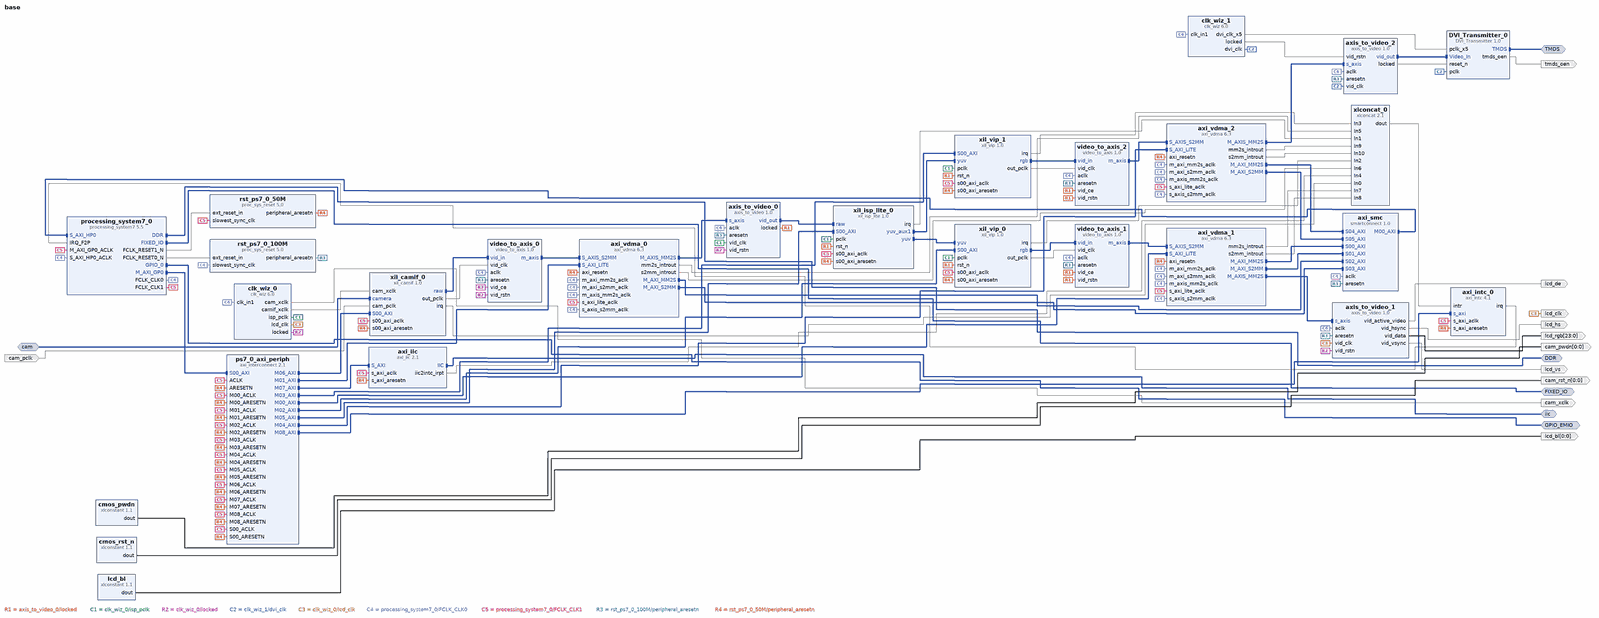
[diagram p0: block diagram of the top level, whole]
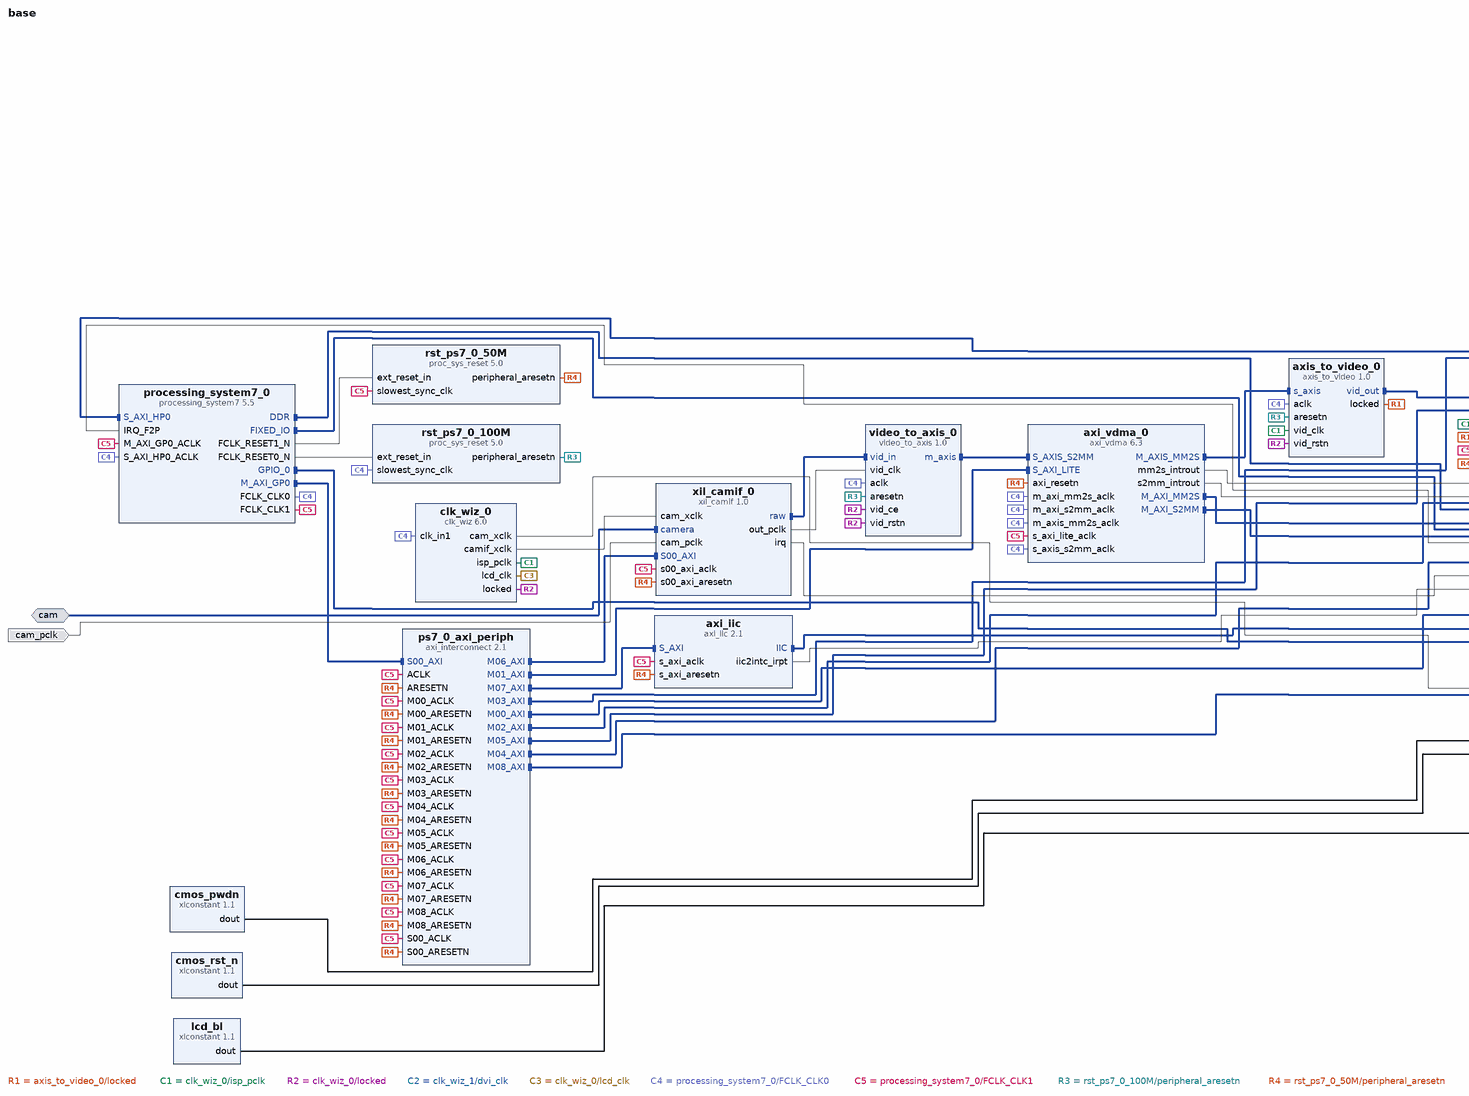
[diagram p1: block diagram of the top level, left part]
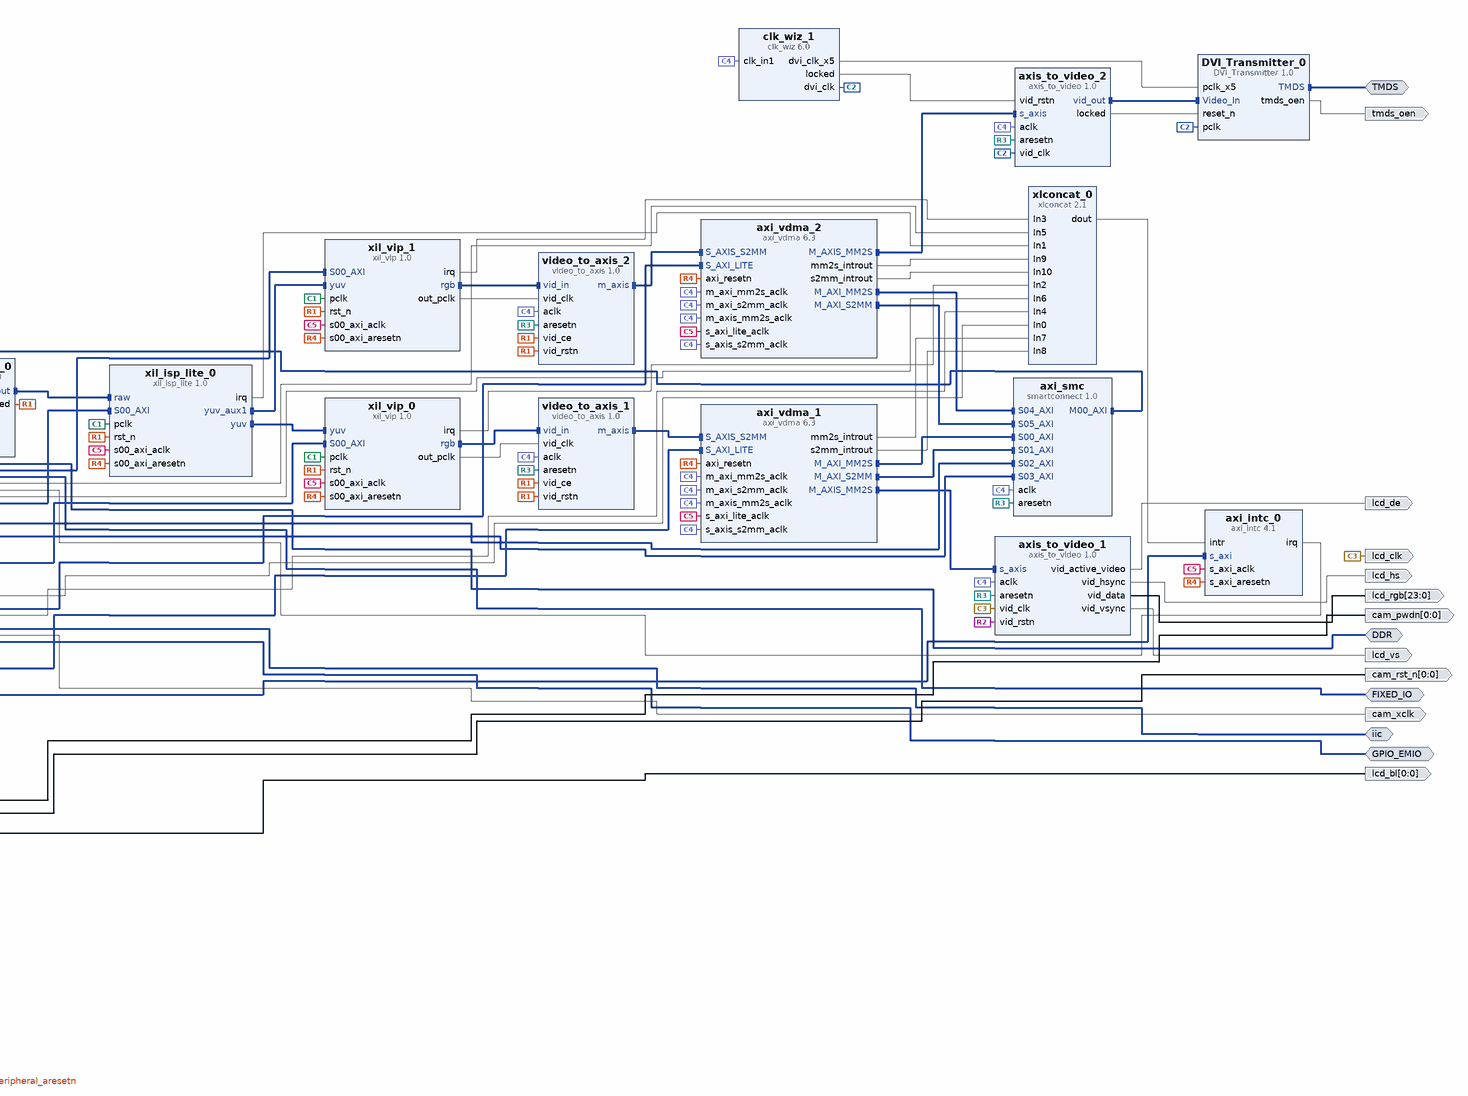
[diagram p2: block diagram of the top level, right part]
# Vivado block design base, xc7z020clg400-2, Vivado 2021.1
create_bd_design base

create_bd_intf_port -mode Master -vlnv xilinx.com:interface:ddrx_rtl:1.0 DDR
create_bd_intf_port -mode Master -vlnv xilinx.com:display_processing_system7:fixedio_rtl:1.0 FIXED_IO
create_bd_intf_port -mode Master -vlnv openedv.com:user:TMDS_rtl:1.0 TMDS
create_bd_intf_port -mode Slave -vlnv xilinx.com:interface:vid_io_rtl:1.0 cam
create_bd_intf_port -mode Master -vlnv xilinx.com:interface:iic_rtl:1.0 iic
create_bd_intf_port -mode Master -vlnv xilinx.com:interface:gpio_rtl:1.0 GPIO_EMIO
create_bd_port -dir O lcd_de
create_bd_port -dir O -from 23 -to 0 lcd_rgb
create_bd_port -dir O lcd_hs
create_bd_port -dir O lcd_vs
create_bd_port -dir O -type clk lcd_clk
create_bd_port -dir O -from 0 -to 0 lcd_bl
create_bd_port -dir O -from 0 -to 0 cam_rst_n
create_bd_port -dir O -from 0 -to 0 cam_pwdn
create_bd_port -dir O tmds_oen
create_bd_port -dir I -type clk cam_pclk
create_bd_port -dir O -type clk cam_xclk
set_property -dict {CONFIG.FREQ_HZ 24000000} [get_bd_ports cam_xclk]

create_bd_cell -type ip -vlnv xilinx.com:ip:processing_system7:5.5 processing_system7_0
set_property -dict [list \
  CONFIG.PCW_APU_PERIPHERAL_FREQMHZ 666.666666 \
  CONFIG.PCW_CPU_CPU_6X4X_MAX_RANGE 767 \
  CONFIG.PCW_ENET0_PERIPHERAL_ENABLE 0 \
  CONFIG.PCW_EN_CLK1_PORT 1 \
  CONFIG.PCW_EN_RST1_PORT 1 \
  CONFIG.PCW_FCLK_CLK1_BUF TRUE \
  CONFIG.PCW_FPGA0_PERIPHERAL_FREQMHZ 120 \
  CONFIG.PCW_FPGA1_PERIPHERAL_FREQMHZ 50 \
  CONFIG.PCW_FPGA_FCLK1_ENABLE 1 \
  CONFIG.PCW_GPIO_EMIO_GPIO_ENABLE 1 \
  CONFIG.PCW_GPIO_EMIO_GPIO_IO 5 \
  CONFIG.PCW_GPIO_EMIO_GPIO_WIDTH 5 \
  CONFIG.PCW_GPIO_MIO_GPIO_ENABLE 1 \
  CONFIG.PCW_GPIO_MIO_GPIO_IO MIO \
  CONFIG.PCW_I2C_RESET_ENABLE 0 \
  CONFIG.PCW_IRQ_F2P_INTR 1 \
  CONFIG.PCW_PERIPHERAL_BOARD_PRESET None \
  CONFIG.PCW_PRESET_BANK1_VOLTAGE {LVCMOS 1.8V} \
  CONFIG.PCW_QSPI_PERIPHERAL_ENABLE 0 \
  CONFIG.PCW_SD0_GRP_CD_ENABLE 1 \
  CONFIG.PCW_SD0_GRP_CD_IO {MIO 10} \
  CONFIG.PCW_SD0_GRP_WP_ENABLE 0 \
  CONFIG.PCW_SD0_PERIPHERAL_ENABLE 1 \
  CONFIG.PCW_SD0_SD0_IO {MIO 40 .. 45} \
  CONFIG.PCW_SDIO_PERIPHERAL_FREQMHZ 100 \
  CONFIG.PCW_UART0_PERIPHERAL_ENABLE 1 \
  CONFIG.PCW_UART0_UART0_IO {MIO 14 .. 15} \
  CONFIG.PCW_UART1_PERIPHERAL_ENABLE 0 \
  CONFIG.PCW_UART_PERIPHERAL_FREQMHZ 100 \
  CONFIG.PCW_UIPARAM_DDR_FREQ_MHZ 533.333333 \
  CONFIG.PCW_UIPARAM_DDR_PARTNO {MT41J256M16 RE-125} \
  CONFIG.PCW_USB0_PERIPHERAL_ENABLE 0 \
  CONFIG.PCW_USB_RESET_ENABLE 0 \
  CONFIG.PCW_USE_FABRIC_INTERRUPT 1 \
  CONFIG.PCW_USE_S_AXI_HP0 1 \
  CONFIG.preset None \
] [get_bd_cells processing_system7_0]
# 496 more settings of processing_system7_0 are not shown: defaults, MIO pin electricals, DDR timing, and values the tool derives
create_bd_cell -type ip -vlnv xilinx.com:ip:proc_sys_reset:5.0 rst_ps7_0_100M
create_bd_cell -type ip -vlnv xilinx.com:ip:proc_sys_reset:5.0 rst_ps7_0_50M
create_bd_cell -type ip -vlnv xilinx.com:ip:axi_iic:2.1 axi_iic
create_bd_cell -type ip -vlnv xilinx.com:ip:axi_intc:4.1 axi_intc_0
create_bd_cell -type ip -vlnv xilinx.com:ip:smartconnect:1.0 axi_smc
set_property -dict {CONFIG.NUM_SI 6} [get_bd_cells axi_smc]
create_bd_cell -type ip -vlnv xilinx.com:ip:axi_vdma:6.3 axi_vdma_0
set_property -dict [list \
  CONFIG.c_m_axis_mm2s_tdata_width 8 \
  CONFIG.c_mm2s_linebuffer_depth 4096 \
  CONFIG.c_mm2s_max_burst_length 256 \
  CONFIG.c_s2mm_linebuffer_depth 4096 \
  CONFIG.c_s2mm_max_burst_length 256 \
] [get_bd_cells axi_vdma_0]
create_bd_cell -type ip -vlnv xilinx.com:ip:axi_vdma:6.3 axi_vdma_1
set_property -dict [list \
  CONFIG.c_m_axis_mm2s_tdata_width 24 \
  CONFIG.c_mm2s_linebuffer_depth 1024 \
  CONFIG.c_mm2s_max_burst_length 32 \
  CONFIG.c_s2mm_linebuffer_depth 1024 \
  CONFIG.c_s2mm_max_burst_length 32 \
] [get_bd_cells axi_vdma_1]
create_bd_cell -type ip -vlnv xilinx.com:ip:axi_vdma:6.3 axi_vdma_2
set_property -dict [list \
  CONFIG.c_m_axis_mm2s_tdata_width 24 \
  CONFIG.c_mm2s_linebuffer_depth 2048 \
  CONFIG.c_mm2s_max_burst_length 32 \
  CONFIG.c_s2mm_linebuffer_depth 2048 \
  CONFIG.c_s2mm_max_burst_length 32 \
] [get_bd_cells axi_vdma_2]
create_bd_cell -type ip -vlnv xilinx.com:ip:clk_wiz:6.0 clk_wiz_0
set_property -dict [list \
  CONFIG.CLKIN1_JITTER_PS 83.33 \
  CONFIG.CLKOUT1_JITTER 114.420 \
  CONFIG.CLKOUT1_PHASE_ERROR 86.077 \
  CONFIG.CLKOUT1_REQUESTED_OUT_FREQ 96 \
  CONFIG.CLKOUT2_JITTER 109.763 \
  CONFIG.CLKOUT2_PHASE_ERROR 86.077 \
  CONFIG.CLKOUT2_REQUESTED_OUT_FREQ 120 \
  CONFIG.CLKOUT2_USED true \
  CONFIG.CLKOUT3_JITTER 141.764 \
  CONFIG.CLKOUT3_PHASE_ERROR 86.077 \
  CONFIG.CLKOUT3_REQUESTED_OUT_FREQ 33.333 \
  CONFIG.CLKOUT3_USED true \
  CONFIG.CLKOUT4_JITTER 152.237 \
  CONFIG.CLKOUT4_PHASE_ERROR 86.077 \
  CONFIG.CLKOUT4_REQUESTED_OUT_FREQ 24 \
  CONFIG.CLKOUT4_USED true \
  CONFIG.CLK_OUT1_PORT camif_xclk \
  CONFIG.CLK_OUT2_PORT isp_pclk \
  CONFIG.CLK_OUT3_PORT lcd_clk \
  CONFIG.CLK_OUT4_PORT cam_xclk \
  CONFIG.MMCM_CLKFBOUT_MULT_F 10.000 \
  CONFIG.MMCM_CLKIN1_PERIOD 8.333 \
  CONFIG.MMCM_CLKIN2_PERIOD 10.000 \
  CONFIG.MMCM_CLKOUT0_DIVIDE_F 12.500 \
  CONFIG.MMCM_CLKOUT1_DIVIDE 10 \
  CONFIG.MMCM_CLKOUT2_DIVIDE 36 \
  CONFIG.MMCM_CLKOUT3_DIVIDE 50 \
  CONFIG.MMCM_DIVCLK_DIVIDE 1 \
  CONFIG.NUM_OUT_CLKS 4 \
  CONFIG.USE_RESET false \
] [get_bd_cells clk_wiz_0]
create_bd_cell -type ip -vlnv xilinx.com:ip:clk_wiz:6.0 clk_wiz_1
set_property -dict [list \
  CONFIG.CLKIN1_JITTER_PS 83.33 \
  CONFIG.CLKOUT1_DRIVES BUFG \
  CONFIG.CLKOUT1_JITTER 187.199 \
  CONFIG.CLKOUT1_PHASE_ERROR 196.436 \
  CONFIG.CLKOUT1_REQUESTED_OUT_FREQ 74.25 \
  CONFIG.CLKOUT2_DRIVES BUFG \
  CONFIG.CLKOUT2_JITTER 145.809 \
  CONFIG.CLKOUT2_PHASE_ERROR 196.436 \
  CONFIG.CLKOUT2_REQUESTED_OUT_FREQ 371.25 \
  CONFIG.CLKOUT2_USED true \
  CONFIG.CLKOUT3_DRIVES BUFG \
  CONFIG.CLKOUT4_DRIVES BUFG \
  CONFIG.CLKOUT5_DRIVES BUFG \
  CONFIG.CLKOUT6_DRIVES BUFG \
  CONFIG.CLKOUT7_DRIVES BUFG \
  CONFIG.CLK_OUT1_PORT dvi_clk \
  CONFIG.CLK_OUT2_PORT dvi_clk_x5 \
  CONFIG.FEEDBACK_SOURCE FDBK_AUTO \
  CONFIG.MMCM_CLKFBOUT_MULT_F 37.125 \
  CONFIG.MMCM_CLKIN1_PERIOD 8.333 \
  CONFIG.MMCM_CLKIN2_PERIOD 10.000 \
  CONFIG.MMCM_CLKOUT0_DIVIDE_F 15.000 \
  CONFIG.MMCM_CLKOUT1_DIVIDE 3 \
  CONFIG.MMCM_COMPENSATION ZHOLD \
  CONFIG.MMCM_DIVCLK_DIVIDE 4 \
  CONFIG.NUM_OUT_CLKS 2 \
  CONFIG.PRIMITIVE MMCM \
  CONFIG.USE_RESET false \
] [get_bd_cells clk_wiz_1]
create_bd_cell -type ip -vlnv xilinx.com:ip:xlconstant:1.1 cmos_pwdn
set_property -dict {CONFIG.CONST_VAL 0} [get_bd_cells cmos_pwdn]
create_bd_cell -type ip -vlnv xilinx.com:ip:xlconstant:1.1 cmos_rst_n
create_bd_cell -type ip -vlnv xilinx.com:ip:xlconstant:1.1 lcd_bl
create_bd_cell -type ip -vlnv xilinx.com:ip:axi_interconnect:2.1 ps7_0_axi_periph
set_property -dict {CONFIG.NUM_MI 9} [get_bd_cells ps7_0_axi_periph]
create_bd_cell -type ip -vlnv xilinx.com:ip:xlconcat:2.1 xlconcat_0
set_property -dict {CONFIG.NUM_PORTS 11 CONFIG.dout_width 11} [get_bd_cells xlconcat_0]
create_bd_cell -type ip -vlnv openedv.com:user:DVI_Transmitter:1.0 DVI_Transmitter_0
create_bd_cell -type ip -vlnv bxq.com:user:axis_to_video:1.0 axis_to_video_0
set_property -dict {CONFIG.ADDR_BITS 12 CONFIG.H_DISP 2592 CONFIG.V_DISP 1944} [get_bd_cells axis_to_video_0]
create_bd_cell -type ip -vlnv bxq.com:user:axis_to_video:1.0 axis_to_video_1
set_property -dict [list \
  CONFIG.ADDR_BITS 10 \
  CONFIG.DATA_BITS 24 \
  CONFIG.H_BACK 88 \
  CONFIG.H_DISP 800 \
  CONFIG.H_FRONT 40 \
  CONFIG.H_PULSE 128 \
  CONFIG.V_BACK 33 \
  CONFIG.V_DISP 480 \
  CONFIG.V_FRONT 10 \
  CONFIG.V_PULSE 2 \
] [get_bd_cells axis_to_video_1]
create_bd_cell -type ip -vlnv bxq.com:user:axis_to_video:1.0 axis_to_video_2
set_property -dict [list \
  CONFIG.ADDR_BITS 11 \
  CONFIG.DATA_BITS 24 \
  CONFIG.H_BACK 220 \
  CONFIG.H_FRONT 110 \
  CONFIG.H_PULSE 40 \
  CONFIG.V_BACK 21 \
  CONFIG.V_DISP 720 \
  CONFIG.V_FRONT 4 \
  CONFIG.V_PULSE 5 \
] [get_bd_cells axis_to_video_2]
create_bd_cell -type ip -vlnv bxq.com:user:video_to_axis:1.0 video_to_axis_0
set_property -dict {CONFIG.ADDR_BITS 12} [get_bd_cells video_to_axis_0]
create_bd_cell -type ip -vlnv bxq.com:user:video_to_axis:1.0 video_to_axis_1
set_property -dict {CONFIG.ADDR_BITS 10 CONFIG.DATA_BITS 24} [get_bd_cells video_to_axis_1]
create_bd_cell -type ip -vlnv bxq.com:user:video_to_axis:1.0 video_to_axis_2
set_property -dict {CONFIG.ADDR_BITS 11 CONFIG.DATA_BITS 24} [get_bd_cells video_to_axis_2]
create_bd_cell -type ip -vlnv bxq.com:user:xil_camif:1.0 xil_camif_0
set_property -dict [list \
  CONFIG.COLORBAR_BAYER 3 \
  CONFIG.COLORBAR_H_BACK 50 \
  CONFIG.COLORBAR_H_DISP 2592 \
  CONFIG.COLORBAR_H_FRONT 50 \
  CONFIG.COLORBAR_H_PULSE 100 \
  CONFIG.COLORBAR_V_BACK 5 \
  CONFIG.COLORBAR_V_DISP 1944 \
  CONFIG.COLORBAR_V_FRONT 5 \
  CONFIG.COLORBAR_V_PULSE 10 \
] [get_bd_cells xil_camif_0]
create_bd_cell -type ip -vlnv bxq.com:user:xil_isp_lite:1.0 xil_isp_lite_0
set_property -dict [list \
  CONFIG.BAYER 3 \
  CONFIG.EXT_BITS 1 \
  CONFIG.FEATURE_FULL true \
  CONFIG.HEIGHT 1944 \
  CONFIG.IO_BITS 8 \
  CONFIG.WIDTH 2592 \
  CONFIG.YUV_AUX_NUM 1 \
] [get_bd_cells xil_isp_lite_0]
create_bd_cell -type ip -vlnv bxq.com:user:xil_vip:1.0 xil_vip_0
set_property -dict {CONFIG.BITS 8 CONFIG.FEATURE_FULL true CONFIG.HEIGHT 1944 CONFIG.WIDTH 2592} [get_bd_cells xil_vip_0]
create_bd_cell -type ip -vlnv bxq.com:user:xil_vip:1.0 xil_vip_1
set_property -dict {CONFIG.FEATURE_FULL true CONFIG.HEIGHT 1944 CONFIG.WIDTH 2592} [get_bd_cells xil_vip_1]

# ---- connections ----

connect_bd_intf_net [get_bd_intf_ports TMDS] [get_bd_intf_pins DVI_Transmitter_0/TMDS]
connect_bd_intf_net [get_bd_intf_ports iic] [get_bd_intf_pins axi_iic/IIC]
connect_bd_intf_net [get_bd_intf_pins axi_smc/M00_AXI] [get_bd_intf_pins processing_system7_0/S_AXI_HP0]
connect_bd_intf_net [get_bd_intf_pins axi_vdma_0/M_AXIS_MM2S] [get_bd_intf_pins axis_to_video_0/s_axis]
connect_bd_intf_net [get_bd_intf_pins axi_vdma_0/M_AXI_MM2S] [get_bd_intf_pins axi_smc/S02_AXI]
connect_bd_intf_net [get_bd_intf_pins axi_vdma_0/M_AXI_S2MM] [get_bd_intf_pins axi_smc/S03_AXI]
connect_bd_intf_net [get_bd_intf_pins axi_vdma_1/M_AXIS_MM2S] [get_bd_intf_pins axis_to_video_1/s_axis]
connect_bd_intf_net [get_bd_intf_pins axi_vdma_1/M_AXI_MM2S] [get_bd_intf_pins axi_smc/S00_AXI]
connect_bd_intf_net [get_bd_intf_pins axi_vdma_1/M_AXI_S2MM] [get_bd_intf_pins axi_smc/S01_AXI]
connect_bd_intf_net [get_bd_intf_pins axis_to_video_2/s_axis] [get_bd_intf_pins axi_vdma_2/M_AXIS_MM2S]
connect_bd_intf_net [get_bd_intf_pins axi_vdma_2/M_AXI_MM2S] [get_bd_intf_pins axi_smc/S04_AXI]
connect_bd_intf_net [get_bd_intf_pins axi_vdma_2/M_AXI_S2MM] [get_bd_intf_pins axi_smc/S05_AXI]
connect_bd_intf_net [get_bd_intf_pins axis_to_video_0/vid_out] [get_bd_intf_pins xil_isp_lite_0/raw]
connect_bd_intf_net [get_bd_intf_pins axis_to_video_2/vid_out] [get_bd_intf_pins DVI_Transmitter_0/Video_In]
connect_bd_intf_net -intf_net camera_0_1 [get_bd_intf_ports cam] [get_bd_intf_pins xil_camif_0/camera]
connect_bd_intf_net [get_bd_intf_ports DDR] [get_bd_intf_pins processing_system7_0/DDR]
connect_bd_intf_net [get_bd_intf_ports FIXED_IO] [get_bd_intf_pins processing_system7_0/FIXED_IO]
connect_bd_intf_net [get_bd_intf_ports GPIO_EMIO] [get_bd_intf_pins processing_system7_0/GPIO_0]
connect_bd_intf_net [get_bd_intf_pins processing_system7_0/M_AXI_GP0] [get_bd_intf_pins ps7_0_axi_periph/S00_AXI]
connect_bd_intf_net [get_bd_intf_pins ps7_0_axi_periph/M00_AXI] [get_bd_intf_pins axi_vdma_1/S_AXI_LITE]
connect_bd_intf_net [get_bd_intf_pins ps7_0_axi_periph/M01_AXI] [get_bd_intf_pins axi_vdma_0/S_AXI_LITE]
connect_bd_intf_net [get_bd_intf_pins ps7_0_axi_periph/M02_AXI] [get_bd_intf_pins xil_vip_0/S00_AXI]
connect_bd_intf_net [get_bd_intf_pins ps7_0_axi_periph/M03_AXI] [get_bd_intf_pins xil_vip_1/S00_AXI]
connect_bd_intf_net [get_bd_intf_pins ps7_0_axi_periph/M04_AXI] [get_bd_intf_pins axi_vdma_2/S_AXI_LITE]
connect_bd_intf_net [get_bd_intf_pins ps7_0_axi_periph/M05_AXI] [get_bd_intf_pins xil_isp_lite_0/S00_AXI]
connect_bd_intf_net [get_bd_intf_pins ps7_0_axi_periph/M06_AXI] [get_bd_intf_pins xil_camif_0/S00_AXI]
connect_bd_intf_net [get_bd_intf_pins ps7_0_axi_periph/M07_AXI] [get_bd_intf_pins axi_iic/S_AXI]
connect_bd_intf_net [get_bd_intf_pins ps7_0_axi_periph/M08_AXI] [get_bd_intf_pins axi_intc_0/s_axi]
connect_bd_intf_net [get_bd_intf_pins video_to_axis_0/m_axis] [get_bd_intf_pins axi_vdma_0/S_AXIS_S2MM]
connect_bd_intf_net [get_bd_intf_pins video_to_axis_1/m_axis] [get_bd_intf_pins axi_vdma_1/S_AXIS_S2MM]
connect_bd_intf_net [get_bd_intf_pins video_to_axis_2/m_axis] [get_bd_intf_pins axi_vdma_2/S_AXIS_S2MM]
connect_bd_intf_net [get_bd_intf_pins video_to_axis_0/vid_in] [get_bd_intf_pins xil_camif_0/raw]
connect_bd_intf_net [get_bd_intf_pins xil_isp_lite_0/yuv] [get_bd_intf_pins xil_vip_0/yuv]
connect_bd_intf_net [get_bd_intf_pins xil_isp_lite_0/yuv_aux1] [get_bd_intf_pins xil_vip_1/yuv]
connect_bd_intf_net [get_bd_intf_pins xil_vip_0/rgb] [get_bd_intf_pins video_to_axis_1/vid_in]
connect_bd_intf_net [get_bd_intf_pins video_to_axis_2/vid_in] [get_bd_intf_pins xil_vip_1/rgb]
connect_bd_net [get_bd_pins DVI_Transmitter_0/tmds_oen] [get_bd_ports tmds_oen]
connect_bd_net -net GND_dout [get_bd_pins cmos_pwdn/dout] [get_bd_ports cam_pwdn]
connect_bd_net -net VCC_dout [get_bd_pins cmos_rst_n/dout] [get_bd_ports cam_rst_n]
connect_bd_net [get_bd_pins axi_iic/iic2intc_irpt] [get_bd_pins xlconcat_0/In4]
connect_bd_net [get_bd_pins axi_intc_0/irq] [get_bd_pins processing_system7_0/IRQ_F2P]
connect_bd_net [get_bd_pins axi_vdma_0/mm2s_introut] [get_bd_pins xlconcat_0/In5]
connect_bd_net [get_bd_pins axi_vdma_0/s2mm_introut] [get_bd_pins xlconcat_0/In6]
connect_bd_net [get_bd_pins axi_vdma_1/mm2s_introut] [get_bd_pins xlconcat_0/In7]
connect_bd_net [get_bd_pins axi_vdma_1/s2mm_introut] [get_bd_pins xlconcat_0/In8]
connect_bd_net [get_bd_pins axi_vdma_2/mm2s_introut] [get_bd_pins xlconcat_0/In9]
connect_bd_net [get_bd_pins axi_vdma_2/s2mm_introut] [get_bd_pins xlconcat_0/In10]
connect_bd_net [get_bd_pins axis_to_video_0/locked] \
  [get_bd_pins video_to_axis_1/vid_rstn] [get_bd_pins video_to_axis_1/vid_ce] [get_bd_pins video_to_axis_2/vid_rstn] \
  [get_bd_pins video_to_axis_2/vid_ce] [get_bd_pins xil_isp_lite_0/rst_n] [get_bd_pins xil_vip_0/rst_n] \
  [get_bd_pins xil_vip_1/rst_n]
connect_bd_net [get_bd_pins axis_to_video_1/vid_active_video] [get_bd_ports lcd_de]
connect_bd_net [get_bd_pins axis_to_video_1/vid_data] [get_bd_ports lcd_rgb]
connect_bd_net [get_bd_pins axis_to_video_1/vid_hsync] [get_bd_ports lcd_hs]
connect_bd_net [get_bd_pins axis_to_video_1/vid_vsync] [get_bd_ports lcd_vs]
connect_bd_net [get_bd_pins axis_to_video_2/locked] [get_bd_pins DVI_Transmitter_0/reset_n]
connect_bd_net -net cam_pclk_0_1 [get_bd_ports cam_pclk] [get_bd_pins xil_camif_0/cam_pclk]
connect_bd_net [get_bd_pins clk_wiz_0/cam_xclk] [get_bd_ports cam_xclk]
connect_bd_net [get_bd_pins clk_wiz_0/camif_xclk] [get_bd_pins xil_camif_0/cam_xclk]
connect_bd_net -net clk_wiz_0_clk_160 [get_bd_pins clk_wiz_0/isp_pclk] \
  [get_bd_pins axis_to_video_0/vid_clk] [get_bd_pins xil_isp_lite_0/pclk] [get_bd_pins xil_vip_0/pclk] \
  [get_bd_pins xil_vip_1/pclk]
connect_bd_net [get_bd_pins clk_wiz_0/locked] \
  [get_bd_pins axis_to_video_0/vid_rstn] [get_bd_pins axis_to_video_1/vid_rstn] [get_bd_pins video_to_axis_0/vid_rstn] \
  [get_bd_pins video_to_axis_0/vid_ce]
connect_bd_net [get_bd_pins clk_wiz_1/dvi_clk] [get_bd_pins DVI_Transmitter_0/pclk] [get_bd_pins axis_to_video_2/vid_clk]
connect_bd_net [get_bd_pins clk_wiz_1/dvi_clk_x5] [get_bd_pins DVI_Transmitter_0/pclk_x5]
connect_bd_net [get_bd_pins clk_wiz_1/locked] [get_bd_pins axis_to_video_2/vid_rstn]
connect_bd_net [get_bd_pins lcd_bl/dout] [get_bd_ports lcd_bl]
connect_bd_net -net pll_clk_33m [get_bd_pins clk_wiz_0/lcd_clk] [get_bd_ports lcd_clk] [get_bd_pins axis_to_video_1/vid_clk]
connect_bd_net [get_bd_pins processing_system7_0/FCLK_CLK0] \
  [get_bd_pins processing_system7_0/S_AXI_HP0_ACLK] [get_bd_pins rst_ps7_0_100M/slowest_sync_clk] [get_bd_pins axi_smc/aclk] \
  [get_bd_pins axi_vdma_0/m_axi_mm2s_aclk] [get_bd_pins axi_vdma_0/m_axis_mm2s_aclk] [get_bd_pins axi_vdma_0/m_axi_s2mm_aclk] \
  [get_bd_pins axi_vdma_0/s_axis_s2mm_aclk] [get_bd_pins axi_vdma_1/m_axi_mm2s_aclk] \
  [get_bd_pins axi_vdma_1/m_axis_mm2s_aclk] [get_bd_pins axi_vdma_1/m_axi_s2mm_aclk] \
  [get_bd_pins axi_vdma_1/s_axis_s2mm_aclk] [get_bd_pins axi_vdma_2/m_axi_mm2s_aclk] \
  [get_bd_pins axi_vdma_2/m_axis_mm2s_aclk] [get_bd_pins axi_vdma_2/m_axi_s2mm_aclk] \
  [get_bd_pins axi_vdma_2/s_axis_s2mm_aclk] [get_bd_pins clk_wiz_0/clk_in1] [get_bd_pins clk_wiz_1/clk_in1] \
  [get_bd_pins axis_to_video_0/aclk] [get_bd_pins axis_to_video_1/aclk] [get_bd_pins axis_to_video_2/aclk] \
  [get_bd_pins video_to_axis_0/aclk] [get_bd_pins video_to_axis_1/aclk] [get_bd_pins video_to_axis_2/aclk]
connect_bd_net [get_bd_pins processing_system7_0/FCLK_CLK1] \
  [get_bd_pins processing_system7_0/M_AXI_GP0_ACLK] [get_bd_pins rst_ps7_0_50M/slowest_sync_clk] \
  [get_bd_pins axi_iic/s_axi_aclk] [get_bd_pins axi_intc_0/s_axi_aclk] [get_bd_pins axi_vdma_0/s_axi_lite_aclk] \
  [get_bd_pins axi_vdma_1/s_axi_lite_aclk] [get_bd_pins axi_vdma_2/s_axi_lite_aclk] [get_bd_pins ps7_0_axi_periph/ACLK] \
  [get_bd_pins ps7_0_axi_periph/S00_ACLK] [get_bd_pins ps7_0_axi_periph/M00_ACLK] [get_bd_pins ps7_0_axi_periph/M01_ACLK] \
  [get_bd_pins ps7_0_axi_periph/M02_ACLK] [get_bd_pins ps7_0_axi_periph/M03_ACLK] [get_bd_pins ps7_0_axi_periph/M04_ACLK] \
  [get_bd_pins ps7_0_axi_periph/M05_ACLK] [get_bd_pins ps7_0_axi_periph/M06_ACLK] [get_bd_pins ps7_0_axi_periph/M07_ACLK] \
  [get_bd_pins ps7_0_axi_periph/M08_ACLK] [get_bd_pins xil_camif_0/s00_axi_aclk] [get_bd_pins xil_isp_lite_0/s00_axi_aclk] \
  [get_bd_pins xil_vip_0/s00_axi_aclk] [get_bd_pins xil_vip_1/s00_axi_aclk]
connect_bd_net [get_bd_pins processing_system7_0/FCLK_RESET0_N] [get_bd_pins rst_ps7_0_100M/ext_reset_in]
connect_bd_net [get_bd_pins processing_system7_0/FCLK_RESET1_N] [get_bd_pins rst_ps7_0_50M/ext_reset_in]
connect_bd_net [get_bd_pins rst_ps7_0_100M/peripheral_aresetn] \
  [get_bd_pins axi_smc/aresetn] [get_bd_pins axis_to_video_0/aresetn] [get_bd_pins axis_to_video_1/aresetn] \
  [get_bd_pins axis_to_video_2/aresetn] [get_bd_pins video_to_axis_0/aresetn] [get_bd_pins video_to_axis_1/aresetn] \
  [get_bd_pins video_to_axis_2/aresetn]
connect_bd_net [get_bd_pins rst_ps7_0_50M/peripheral_aresetn] \
  [get_bd_pins axi_iic/s_axi_aresetn] [get_bd_pins axi_intc_0/s_axi_aresetn] [get_bd_pins axi_vdma_0/axi_resetn] \
  [get_bd_pins axi_vdma_1/axi_resetn] [get_bd_pins axi_vdma_2/axi_resetn] [get_bd_pins ps7_0_axi_periph/ARESETN] \
  [get_bd_pins ps7_0_axi_periph/S00_ARESETN] [get_bd_pins ps7_0_axi_periph/M00_ARESETN] \
  [get_bd_pins ps7_0_axi_periph/M01_ARESETN] [get_bd_pins ps7_0_axi_periph/M02_ARESETN] \
  [get_bd_pins ps7_0_axi_periph/M03_ARESETN] [get_bd_pins ps7_0_axi_periph/M04_ARESETN] \
  [get_bd_pins ps7_0_axi_periph/M05_ARESETN] [get_bd_pins ps7_0_axi_periph/M06_ARESETN] \
  [get_bd_pins ps7_0_axi_periph/M07_ARESETN] [get_bd_pins ps7_0_axi_periph/M08_ARESETN] \
  [get_bd_pins xil_camif_0/s00_axi_aresetn] [get_bd_pins xil_isp_lite_0/s00_axi_aresetn] \
  [get_bd_pins xil_vip_0/s00_axi_aresetn] [get_bd_pins xil_vip_1/s00_axi_aresetn]
connect_bd_net [get_bd_pins xil_camif_0/irq] [get_bd_pins xlconcat_0/In0]
connect_bd_net [get_bd_pins xil_camif_0/out_pclk] [get_bd_pins video_to_axis_0/vid_clk]
connect_bd_net [get_bd_pins xil_isp_lite_0/irq] [get_bd_pins xlconcat_0/In1]
connect_bd_net [get_bd_pins xil_vip_0/irq] [get_bd_pins xlconcat_0/In2]
connect_bd_net [get_bd_pins xil_vip_0/out_pclk] [get_bd_pins video_to_axis_1/vid_clk]
connect_bd_net [get_bd_pins xil_vip_1/irq] [get_bd_pins xlconcat_0/In3]
connect_bd_net [get_bd_pins xil_vip_1/out_pclk] [get_bd_pins video_to_axis_2/vid_clk]
connect_bd_net [get_bd_pins xlconcat_0/dout] [get_bd_pins axi_intc_0/intr]

# ---- address map ----
assign_bd_address -offset 0x00000000 -range 1G -target_address_space [get_bd_addr_spaces axi_vdma_0/Data_MM2S] [get_bd_addr_segs processing_system7_0/S_AXI_HP0/HP0_DDR_LOWOCM]
assign_bd_address -offset 0x00000000 -range 1G -target_address_space [get_bd_addr_spaces axi_vdma_0/Data_S2MM] [get_bd_addr_segs processing_system7_0/S_AXI_HP0/HP0_DDR_LOWOCM]
assign_bd_address -offset 0x00000000 -range 1G -target_address_space [get_bd_addr_spaces axi_vdma_1/Data_MM2S] [get_bd_addr_segs processing_system7_0/S_AXI_HP0/HP0_DDR_LOWOCM]
assign_bd_address -offset 0x00000000 -range 1G -target_address_space [get_bd_addr_spaces axi_vdma_1/Data_S2MM] [get_bd_addr_segs processing_system7_0/S_AXI_HP0/HP0_DDR_LOWOCM]
assign_bd_address -offset 0x00000000 -range 1G -target_address_space [get_bd_addr_spaces axi_vdma_2/Data_MM2S] [get_bd_addr_segs processing_system7_0/S_AXI_HP0/HP0_DDR_LOWOCM]
assign_bd_address -offset 0x00000000 -range 1G -target_address_space [get_bd_addr_spaces axi_vdma_2/Data_S2MM] [get_bd_addr_segs processing_system7_0/S_AXI_HP0/HP0_DDR_LOWOCM]
assign_bd_address -offset 0x41600000 -range 64K -target_address_space [get_bd_addr_spaces processing_system7_0/Data] [get_bd_addr_segs axi_iic/S_AXI/Reg]
assign_bd_address -offset 0x41800000 -range 64K -target_address_space [get_bd_addr_spaces processing_system7_0/Data] [get_bd_addr_segs axi_intc_0/S_AXI/Reg]
assign_bd_address -offset 0x43000000 -range 64K -target_address_space [get_bd_addr_spaces processing_system7_0/Data] [get_bd_addr_segs axi_vdma_1/S_AXI_LITE/Reg]
assign_bd_address -offset 0x43010000 -range 64K -target_address_space [get_bd_addr_spaces processing_system7_0/Data] [get_bd_addr_segs axi_vdma_0/S_AXI_LITE/Reg]
assign_bd_address -offset 0x43020000 -range 64K -target_address_space [get_bd_addr_spaces processing_system7_0/Data] [get_bd_addr_segs axi_vdma_2/S_AXI_LITE/Reg]
assign_bd_address -offset 0x43C00000 -range 64K -target_address_space [get_bd_addr_spaces processing_system7_0/Data] [get_bd_addr_segs xil_vip_0/S00_AXI/S00_AXI_reg]
assign_bd_address -offset 0x43C10000 -range 64K -target_address_space [get_bd_addr_spaces processing_system7_0/Data] [get_bd_addr_segs xil_vip_1/S00_AXI/S00_AXI_reg]
assign_bd_address -offset 0x43C20000 -range 64K -target_address_space [get_bd_addr_spaces processing_system7_0/Data] [get_bd_addr_segs xil_isp_lite_0/S00_AXI/S00_AXI_reg]
assign_bd_address -offset 0x43C30000 -range 64K -target_address_space [get_bd_addr_spaces processing_system7_0/Data] [get_bd_addr_segs xil_camif_0/S00_AXI/S00_AXI_reg]

validate_bd_design
save_bd_design
